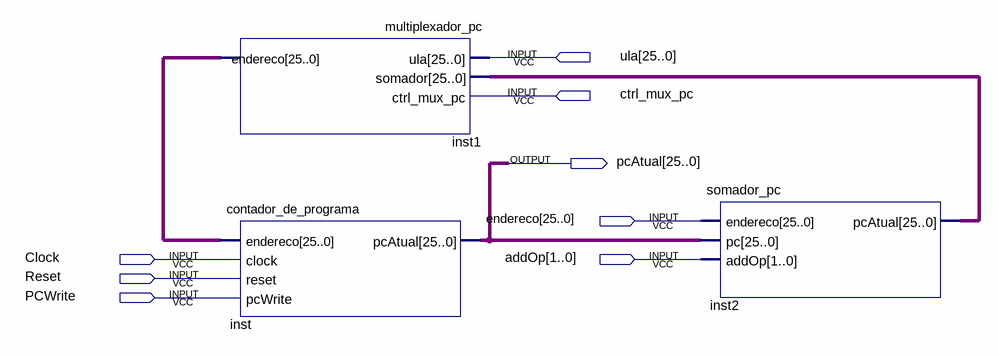
[diagram p0: schematic sheet]
// Quartus schematic pc_somador_mux.bdf as structural Verilog: 3 symbols, 8 pins
module pc_somador_mux (
  input  [25:0] ula,
  input  ctrl_mux_pc,
  input  [25:0] endereco,
  input  Clock,
  input  [1:0] addOp,
  input  Reset,
  input  PCWrite,
  output [25:0] pcAtual
);

  wire [25:0] inst1_endereco, inst2_pcatual;

  multiplexador_pc inst1 (.ula(ula), .somador(inst2_pcatual), .ctrl_mux_pc(ctrl_mux_pc), .endereco(inst1_endereco));
  contador_de_programa inst (
    .endereco(inst1_endereco), .clock(Clock), .reset(Reset), .pcWrite(PCWrite), .pcAtual(pcAtual));
  somador_pc inst2 (.endereco(endereco), .pc(pcAtual), .addOp(addOp), .pcAtual(inst2_pcatual));
endmodule
